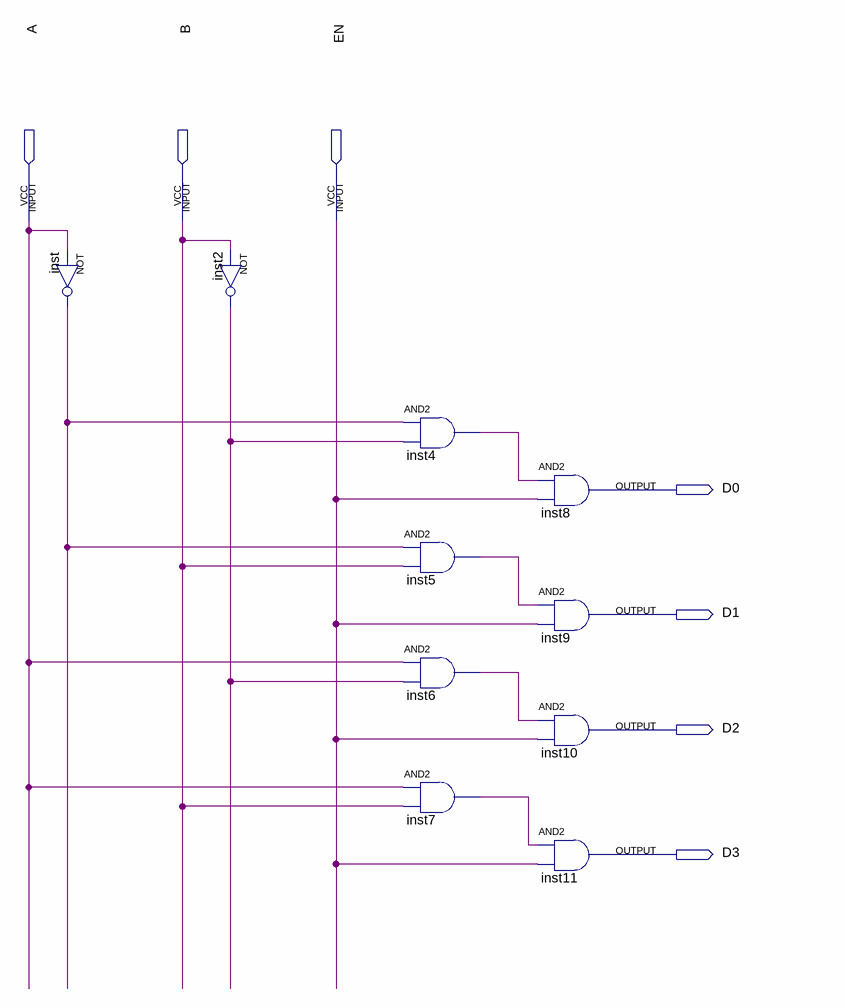
[diagram p0: schematic sheet]
// Quartus schematic 24Decoder.bdf as structural Verilog: 10 symbols, 7 pins
module \24Decoder  (
  input  A,
  input  B,
  input  EN,
  output D0,
  output D1,
  output D2,
  output D3
);

  wire inst2_out, inst4_out, inst5_out, inst6_out, inst7_out, inst_out;

  not inst (inst_out, A);
  not inst2 (inst2_out, B);
  and inst4 (inst4_out, inst_out, inst2_out);
  and inst5 (inst5_out, inst_out, B);
  and inst6 (inst6_out, A, inst2_out);
  and inst7 (inst7_out, A, B);
  and inst8 (D0, inst4_out, EN);
  and inst9 (D1, inst5_out, EN);
  and inst10 (D2, inst6_out, EN);
  and inst11 (D3, inst7_out, EN);
endmodule
